# EAGLE schematic SSU-rev5 (EAGLE 7.2.0)
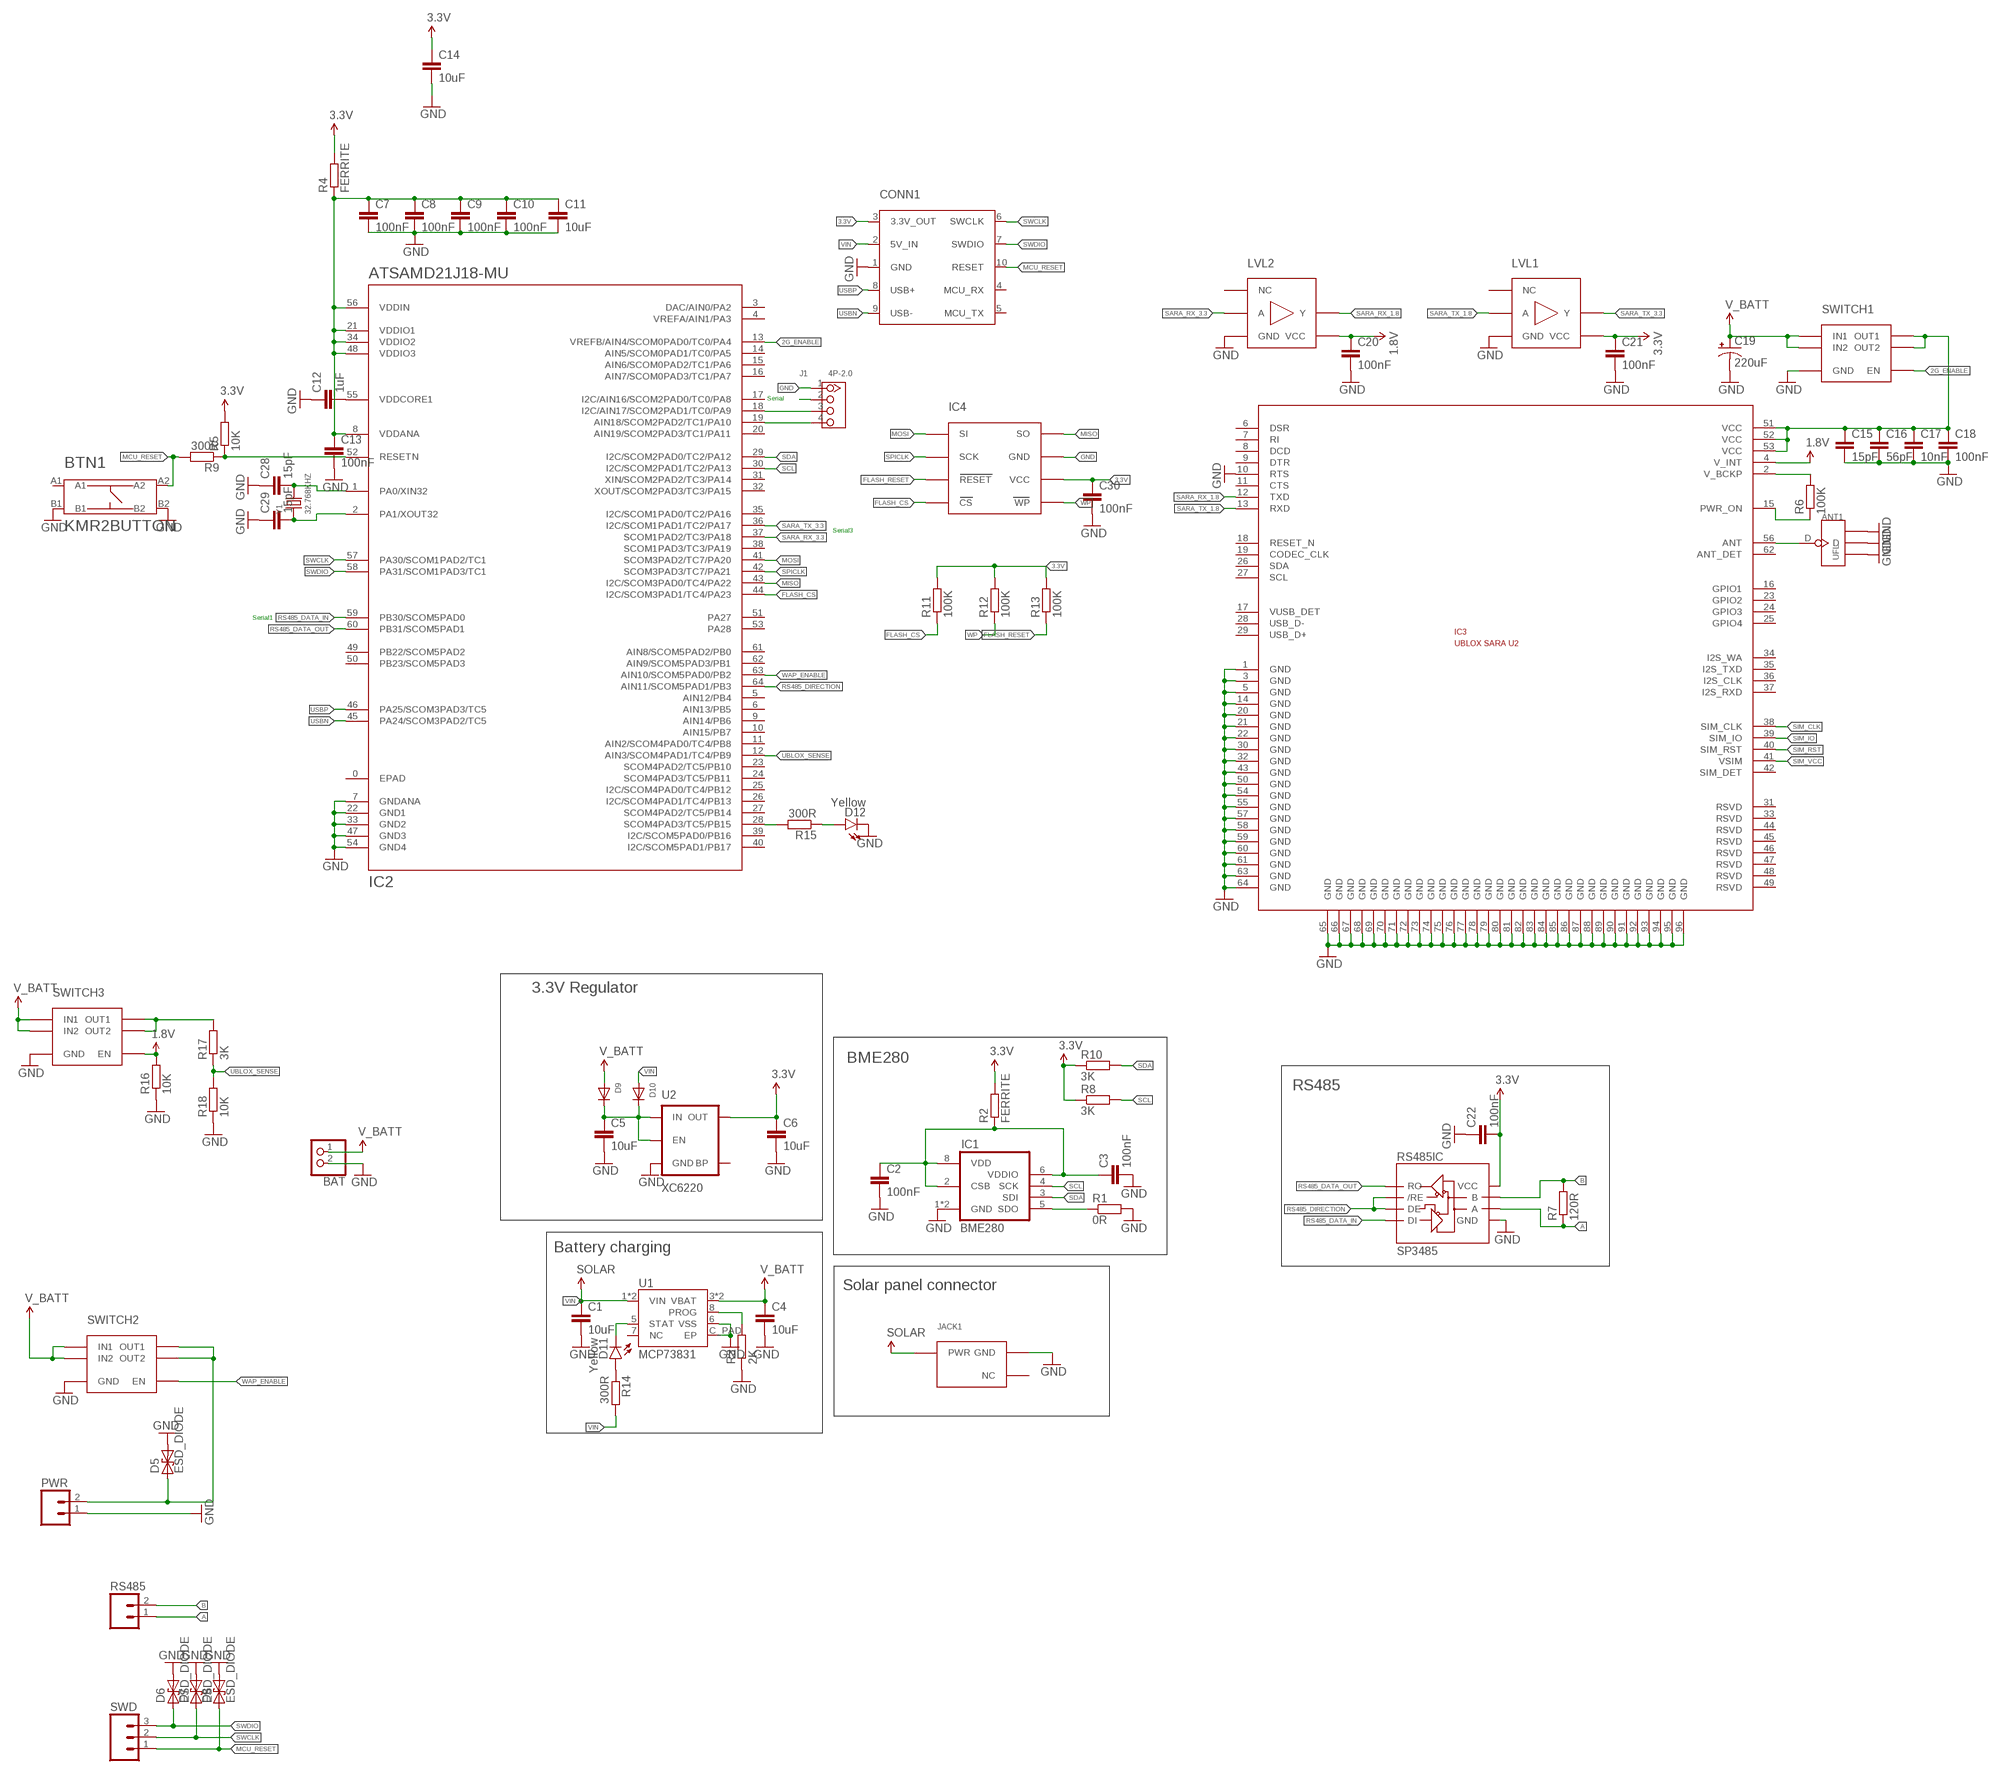
[diagram p0: schematic, sheet 1, part 1 of 2]
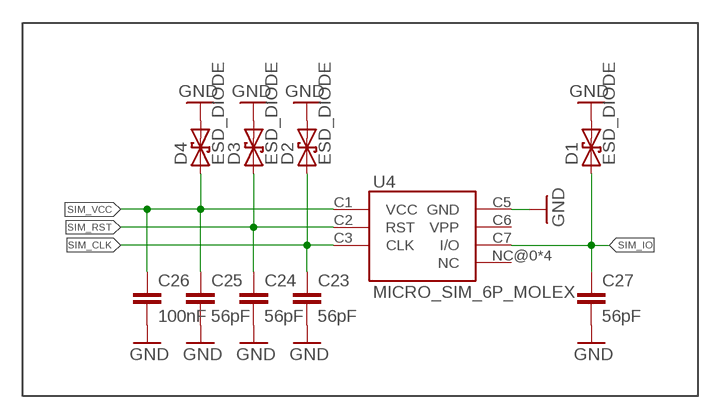
[diagram p1: schematic, sheet 1, part 2 of 2]

## Parts
ANT1  UFL  U-FL-CONNECTOR-3450020P1  [U-FL]
BAT  JST_2PIN-SMT-RA  [JST-PH-2-SMT-RA]
BTN1  KMR2BUTTON  [KMR2BUTTON]
C1  10uF  C_0603  [C0603]
C2  100nF  C_0402  [C0402]
C3  100nF  C_0402  [C0402]
C4  10uF  C_0603  [C0603]
C5  10uF  C_0603  [C0603]
C6  10uF  C_0603  [C0603]
C7  100nF  C_0402  [C0402]
C8  100nF  C_0402  [C0402]
C9  100nF  C_0402  [C0402]
C10  100nF  C_0402  [C0402]
C11  10uF  C_0603  [C0603]
C12  1uF  C_0402  [C0402]
C13  100nF  C_0402  [C0402]
C14  10uF  C_0603  [C0603]
C15  15pF  C_0402  [C0402]
C16  56pF  C_0402  [C0402]
C17  10nF  C_0402  [C0402]
C18  100nF  C_0402  [C0402]
C19  220uF  CAP_POL3528  [EIA3528]
C20  100nF  C_0402  [C0402]
C21  100nF  C_0402  [C0402]
C22  100nF  C_0402  [C0402]
C23  56pF  C_0402  [C0402]
C24  56pF  C_0402  [C0402]
C25  56pF  C_0402  [C0402]
C26  100nF  C_0402  [C0402]
C27  56pF  C_0402  [C0402]
C28  15pF  C_0402  [C0402]
C29  15pF  C_0402  [C0402]
C30  100nF  C_0402  [C0402]
CONN1  TC-10PIN  [TC2050-IDC]
D1  ESD_DIODE  [R0402]
D2  ESD_DIODE  [R0402]
D3  ESD_DIODE  [R0402]
D4  ESD_DIODE  [R0402]
D5  ESD_DIODE  [R0402]
D6  ESD_DIODE  [R0402]
D7  ESD_DIODE  [R0402]
D8  ESD_DIODE  [R0402]
D9  DIODESOD-323F  [SOD-323F]
D10  DIODESOD-323F  [SOD-323F]
D11  Yellow  LED-YELLOW0603  [LED-0603]
D12  Yellow  LED-YELLOW0603  [LED-0603]
IC1  BME280  [BME280]
IC2  ATSAMD21J18-MU  [QFN64]
IC3  UBLOX_SARA_U2STANDARD  [SARA-U2]
IC4  AT45DB161E  [SOIC127P600X175-8N]
J1  4P-2.0  GROVE-CONNECTOR-DIP(4P-2.0)  [HW4-2.0]
JACK1  SSU-POWER-JACK  [SSU-POWER-JACK]
LVL1  SN74LV1T34DBVR  [SOT23-5]
LVL2  SN74LV1T34DBVR  [SOT23-5]
PWR  M02PTH3  [1X02_LONGPADS]
R1  0R  R_0402  [R0402]
R2  FERRITE  R_0603  [R0603]
R3  2K  R_0402  [R0402]
R4  FERRITE  R_0603  [R0603]
R5  10K  R_0402  [R0402]
R6  100K  R_0402  [R0402]
R7  120R  R_0603  [R0603]
R8  3K  R_0402  [R0402]
R9  300R  R_0402  [R0402]
R10  3K  R_0402  [R0402]
R11  100K  R_0402  [R0402]
R12  100K  R_0402  [R0402]
R13  100K  R_0402  [R0402]
R14  300R  R_0402  [R0402]
R15  300R  R_0402  [R0402]
R16  10K  R_0402  [R0402]
R17  3K  R_0402  [R0402]
R18  10K  R_0402  [R0402]
RS485  M02PTH3  [1X02_LONGPADS]
RS485IC  SP3485  RS485SOIC  [SO08]
SWD  M03LONGPADS  [1X03_LONGPADS]
SWITCH1  SIP32510  [TSOT23-6]
SWITCH2  SIP32510  [TSOT23-6]
SWITCH3  SIP32510  [TSOT23-6]
U1  MCP73831  [DFN8-2X3MM]
U2  XC6220  V_REG_LDOSMD  [SOT23-5]
U4  MICRO_SIM_6P_MOLEX  [MICRO_SIM_78800-0001]
Y1  32.768KHZ  SMD-CRYSTAL-ABS07-32.768KHZ-7PF-20PPM-70K(2P-3.2X1.5MM)  [X2-SMD-3.2X1.5X0.55MM]

## Nets
1.8V: C20.1 IC3.4(V_INT) LVL2.5(VCC) R16.2 SWITCH3.P$3(EN)
2G_ENABLE: IC2.13(VREFB/AIN4/SCOM0PAD0/TC0/PA4) SWITCH1.P$3(EN)
3.3V: C6.1 C14.1 C21.1 C22.2 C30.1 CONN1.3(3.3V_OUT) IC4.6(VCC) LVL1.5(VCC) R2.2 R4.2 R5.2 R8.1 R10.1 R11.2 R12.2 R13.2 RS485IC.8(VCC) U2.5(OUT)
A: R7.1 RS485.1 RS485IC.6(A)
B: R7.2 RS485.2 RS485IC.7(B)
FLASH_CS: IC2.44(I2C/SCOM3PAD1/TC4/PA23) IC4.4(CS) R11.1
FLASH_RESET: IC4.3(RESET) R13.1
GND: ANT1.GND1 ANT1.GND2 ANT1.GND3 BAT.2 BTN1.B1 BTN1.B2 C1.2 C2.2 C3.2 C4.2 C5.2 C6.2 C7.2 C8.2 C9.2 C10.2 C11.2 C12.1 C13.2 C14.2 C15.2 C16.2 C17.2 C18.2 C19.C(-) C20.2 C21.2 C22.1 C23.2 C24.2 C25.2 C26.2 C27.2 C28.1 C29.1 C30.2 CONN1.1(GND) D1.2 D2.2 D3.2 D4.2 D5.2 D6.2 D7.2 D8.2 D12.C IC1.1(GND) IC1.7(GND) IC2.7(GNDANA) IC2.22(GND1) IC2.33(GND2) IC2.47(GND3) IC2.54(GND4) IC3.1(GND) IC3.3(GND) IC3.5(GND) IC3.10(RTS) IC3.14(GND) IC3.20(GND) IC3.21(GND) IC3.22(GND) IC3.30(GND) IC3.32(GND) IC3.43(GND) IC3.50(GND) IC3.54(GND) IC3.55(GND) IC3.57(GND) IC3.58(GND) IC3.59(GND) IC3.60(GND) IC3.61(GND) IC3.63(GND) IC3.64(GND) IC3.65(GND) IC3.66(GND) IC3.67(GND) IC3.68(GND) IC3.69(GND) IC3.70(GND) IC3.71(GND) IC3.72(GND) IC3.73(GND) IC3.74(GND) IC3.75(GND) IC3.76(GND) IC3.77(GND) IC3.78(GND) IC3.79(GND) IC3.80(GND) IC3.81(GND) IC3.82(GND) IC3.83(GND) IC3.84(GND) IC3.85(GND) IC3.86(GND) IC3.87(GND) IC3.88(GND) IC3.89(GND) IC3.90(GND) IC3.91(GND) IC3.92(GND) IC3.93(GND) IC3.94(GND) IC3.95(GND) IC3.96(GND) IC4.7(GND) J1.1 JACK1.P$2(GND) LVL1.3(GND) LVL2.3(GND) PWR.1 R1.2 R3.1 R16.1 R18.1 RS485IC.5(GND) SWITCH1.P$4(GND) SWITCH2.P$4(GND) SWITCH3.P$4(GND) U1.6(VSS) U1.C_PAD(EP) U2.2(GND) U4.C5(GND)
MCU_RESET: BTN1.A2 CONN1.10(RESET) D8.1 R9.2 SWD.1
MISO: IC2.43(I2C/SCOM3PAD0/TC4/PA22) IC4.8(SO)
MOSI: IC2.41(SCOM3PAD2/TC7/PA20) IC4.1(SI)
N$1: C12.2 IC2.55(VDDCORE1)
N$2: IC2.52(RESETN) R5.1 R9.1
N$3: C28.2 IC2.1(PA0/XIN32) Y1.2
N$4: IC1.5(SDO) R1.1
N$5: C7.1 C8.1 C9.1 C10.1 C11.1 C13.1 IC2.8(VDDANA) IC2.21(VDDIO1) IC2.34(VDDIO2) IC2.48(VDDIO3) IC2.56(VDDIN) R4.1
N$6: R3.2 U1.8(PROG)
N$7: C29.2 IC2.2(PA1/XOUT32) Y1.1
N$8: IC2.18(I2C/AIN17/SCOM2PAD1/TC0/PA9) J1.3
N$9: ANT1.D IC3.56(ANT)
N$10: IC3.2(V_BCKP) R6.2
N$11: IC3.15(PWR_ON) R6.1
N$12: C2.1 C3.1 IC1.2(CSB) IC1.6(VDDIO) IC1.8(VDD) R2.1
N$13: C15.1 C16.1 C17.1 C18.1 IC3.51(VCC) IC3.52(VCC) IC3.53(VCC) SWITCH1.P$1(OUT1) SWITCH1.P$2(OUT2)
N$14: IC2.19(AIN18/SCOM2PAD2/TC1/PA10) J1.4
N$15: D5.1 PWR.2 SWITCH2.P$1(OUT1) SWITCH2.P$2(OUT2)
N$16: C5.1 D9.C D10.C U2.1(IN) U2.3(EN)
N$17: D11.C U1.5(STAT)
N$18: D11.A R14.1
N$19: J1.2
N$20: IC2.28(SCOM4PAD3/TC5/PB15) R15.2
N$21: D12.A R15.1
N$23: R17.2 SWITCH3.P$1(OUT1) SWITCH3.P$2(OUT2)
RS485_DATA_IN: IC2.59(PB30/SCOM5PAD0) RS485IC.4(DI)
RS485_DATA_OUT: IC2.60(PB31/SCOM5PAD1) RS485IC.1(RO)
RS485_DIRECTION: IC2.64(AIN11/SCOM5PAD1/PB3) RS485IC.2(/RE) RS485IC.3(DE)
SARA_RX_1.8: IC3.12(TXD) LVL2.4(Y)
SARA_RX_3.3: IC2.37(SCOM1PAD2/TC3/PA18) LVL2.2(A)
SARA_TX_1.8: IC3.13(RXD) LVL1.2(A)
SARA_TX_3.3: IC2.36(I2C/SCOM1PAD1/TC2/PA17) LVL1.4(Y)
SCL: IC1.4(SCK) IC2.30(I2C/SCOM2PAD1/TC2/PA13) R8.2
SDA: IC1.3(SDI) IC2.29(I2C/SCOM2PAD0/TC2/PA12) R10.2
SIM_CLK: C23.1 D2.1 IC3.38(SIM_CLK) U4.C3(CLK)
SIM_IO: C27.1 D1.1 IC3.39(SIM_IO) U4.C7(I/O)
SIM_RST: C24.1 D3.1 IC3.40(SIM_RST) U4.C2(RST)
SIM_VCC: C25.1 C26.1 D4.1 IC3.41(VSIM) U4.C1(VCC)
SPICLK: IC2.42(SCOM3PAD3/TC7/PA21) IC4.2(SCK)
SWCLK: CONN1.6(SWCLK) D7.1 IC2.57(PA30/SCOM1PAD2/TC1) SWD.2
SWDIO: CONN1.7(SWDIO) D6.1 IC2.58(PA31/SCOM1PAD3/TC1) SWD.3
UBLOX_SENSE: IC2.12(AIN3/SCOM4PAD1/TC4/PB9) R17.1 R18.2
USBN: CONN1.9(USB-) IC2.45(PA24/SCOM3PAD2/TC5)
USBP: CONN1.8(USB+) IC2.46(PA25/SCOM3PAD3/TC5)
V_BATT: BAT.1 C4.1 C19.A(+) D9.A SWITCH1.P$5(IN1) SWITCH1.P$6(IN2) SWITCH2.P$5(IN1) SWITCH2.P$6(IN2) SWITCH3.P$5(IN1) SWITCH3.P$6(IN2) U1.3(VBAT) U1.4(VBAT)
VIN: C1.1 CONN1.2(5V_IN) D10.A JACK1.P$1(PWR) R14.2 U1.1(VIN) U1.2(VIN) ; supply symbol labelled SOLAR
WAP_ENABLE: IC2.63(AIN10/SCOM5PAD0/PB2) SWITCH2.P$3(EN)
WP: IC4.5(WP) R12.1
Unconnected: BTN1.A1 CONN1.4(MCU_RX) CONN1.5(MCU_TX) IC2.3(DAC/AIN0/PA2) IC2.4(VREFA/AIN1/PA3) IC2.5(AIN12/PB4) IC2.6(AIN13/PB5) IC2.9(AIN14/PB6) IC2.10(AIN15/PB7) IC2.11(AIN2/SCOM4PAD0/TC4/PB8) IC2.14(AIN5/SCOM0PAD1/TC0/PA5) IC2.15(AIN6/SCOM0PAD2/TC1/PA6) IC2.16(AIN7/SCOM0PAD3/TC1/PA7) IC2.17(I2C/AIN16/SCOM2PAD0/TC0/PA8) IC2.20(AIN19/SCOM2PAD3/TC1/PA11) IC2.23(SCOM4PAD2/TC5/PB10) IC2.24(SCOM4PAD3/TC5/PB11) IC2.25(I2C/SCOM4PAD0/TC4/PB12) IC2.26(I2C/SCOM4PAD1/TC4/PB13) IC2.27(SCOM4PAD2/TC5/PB14) IC2.31(XIN/SCOM2PAD2/TC3/PA14) IC2.32(XOUT/SCOM2PAD3/TC3/PA15) IC2.35(I2C/SCOM1PAD0/TC2/PA16) IC2.38(SCOM1PAD3/TC3/PA19) IC2.39(I2C/SCOM5PAD0/PB16) IC2.40(I2C/SCOM5PAD1/PB17) IC2.49(PB22/SCOM5PAD2) IC2.50(PB23/SCOM5PAD3) IC2.51(PA27) IC2.53(PA28) IC2.61(AIN8/SCOM5PAD2/PB0) IC2.62(AIN9/SCOM5PAD3/PB1) IC3.6(DSR) IC3.7(RI) IC3.8(DCD) IC3.9(DTR) IC3.11(CTS) IC3.16(GPIO1) IC3.17(VUSB_DET) IC3.18(RESET_N) IC3.19(CODEC_CLK) IC3.23(GPIO2) IC3.24(GPIO3) IC3.25(GPIO4) IC3.26(SDA) IC3.27(SCL) IC3.28(USB_D-) IC3.29(USB_D+) IC3.31(RSVD) IC3.33(RSVD) IC3.34(I2S_WA) IC3.35(I2S_TXD) IC3.36(I2S_CLK) IC3.37(I2S_RXD) IC3.42(SIM_DET) IC3.44(RSVD) IC3.45(RSVD) IC3.46(RSVD) IC3.47(RSVD) IC3.48(RSVD) IC3.49(RSVD) IC3.62(ANT_DET) JACK1.P$3(NC) LVL1.1(NC) LVL2.1(NC) U1.7(NC) U2.4(BP) U4.C6(VPP) U4.NC@0(NC) U4.NC@1(NC) U4.NC@2(NC) U4.NC@3(NC)

## Notes on the sheet
- Serial
- Serial3
- Serial1
- 3.3V Regulator
- BME280
- RS485
- Battery charging
- Solar panel connector

## Power pins joined to a net without a drawn wire
EPAD: IC2.0(EPAD)

## Library data of the parts
ANT1 = Connector:U-FL-CONNECTOR
BAT = adafruit:JST_2PIN: JST 2-Pin Connectors of various flavors SMT-RA (S2B-PH-SM4) 4UConnector #17311 SMT (B2B-PH-SM4) THM-RA (S2B-PH) THM (B2B-PH)
BTN1 = m2m4all:KMR2BUTTON
C1-C18 C20-C30 = gknff:C
C19 = SparkFun-Capacitors:CAP_POL: Capacitor Polarized These are standard SMD and PTH capacitors. Normally 10uF, 47uF, and 100uF in electrolytic and tantalum varieties. Always verify the external diameter of the through hole cap, it varies with capacity, voltage, and manufacturer. The EIA devices should be standard.; FARNELL: 2479900
CONN1 = TagConnect:TC-10PIN
D1-D8 = gknff:ESD_DIODE
D9 D10 = adafruit:DIODE: Diode SMADIODE - SMA Surface Mount Package 20V 1A Schottky Diode Digikey: 641-1014-6-ND DO-1N4148 - Through Hole Small Current Diode SOD-123 20V 1 A (.5mV Vf) Schottky Diode - Digikey: MBRX120TPMSCT-ND SOD-323 10V 570mA (.38mV Vf, 3ns) Schottky Diode - Digikey: ZLLS410CT-ND SOD-523 30V 30mA Schottky Diode (RB751S-40TE61) - Digikey: RB751S-40TE61CT-ND SOT23-R/W - SOT23 Package (R = Solder Paste/Reflow Ovens, W = Hand-Soldering) BAT54Film 40V 300mA - Digikey: 497-7162-1-ND
D11 D12 = SparkFun-LED:LED-YELLOW: Yellow SMD LEDs LilyPad 1206- DIO-09909 0603- DIO-09003 "SMART" means more efficient and expensive; PROD_ID: DIO-09003
IC1 = bosch-bme280:BME280: DIGITAL HUMIDITY, PRESSURE AND TEMPERATURE SENSOR * Digital interface I²C (up to 3.4 MHz) and SPI (3 and 4 wire, up to 10 MHz)* Supply voltage VDD main supply voltage range: 1.71 V to 3.6 V*VDDIO interface voltage range: 1.2 V to 3.6 V Operating range -40…+85 °C, 0…100 % rel. humidity, 300…1100 hPa The library has been designed by Richard Magdycz <https://www.facebook.com/groups/eaglecadsoftUK>
IC2 = gknff:ATSAMD21J18
IC3 = ublox:UBLOX_SARA_U2
IC4 = m2m4all:AT45DB161E
J1 = Seeed-OPL-Connector:GROVE-CONNECTOR-DIP(4P-2.0): 320110033
JACK1 = m2m4all:SSU-POWER-JACK
LVL1 LVL2 = m2m4all:SN74LV1T34DBVR
PWR RS485 = SparkFun-Connectors:M02: Standard 2-pin 0.1" header. Use with - straight break away headers ( PRT-00116) - right angle break away headers (PRT-00553) - swiss pins (PRT-00743) - machine pins (PRT-00117) - female headers (PRT-00115) Molex polarized connector foot print use with: PRT-08233 with associated crimp pins and housings. 2.54_SCREWTERM for use with PRT-10571. 3.5mm Screw Terminal footprints for PRT-08084 5mm Screw Terminal footprints for use with PRT-08432
R1 R3 R5-R18 = gknff:R
R2 R4 = gknff:R; FARNELL: 1515723
RS485IC = SparkFun-DigitalIC:RS485: RS485 transceiver
SWD = SparkFun-Connectors:M03: Header 3 Standard 3-pin 0.1" header. Use with straight break away headers (SKU : PRT-00116), right angle break away headers (PRT-00553), swiss pins (PRT-00743), machine pins (PRT-00117), and female headers (PRT-00115). Molex polarized connector foot print use with SKU : PRT-08232 with associated crimp pins and housings.
SWITCH1-SWITCH3 = m2m4all:SIP32510
U1 = gknff:MCP73831
U2 = SparkFun-PowerIC:V_REG_LDO: Voltage Regulator LDO Standard 150mA LDO voltage regulator in SOT-23 layout. Micrel part MIC5205. BP (by-pass) pin is used to lower output noise with 470pF cap.; FARNELL: 1830935
U4 = gknff:MICRO_SIM_6P
Y1 = Seeed-OPL-crystal-osctllator:SMD-CRYSTAL-ABS07-32.768KHZ-7PF-20PPM-70K(2P-3.2X1.5MM): 306010055; MPN: FC-135